# EAGLE design 2seri1çıkış (EAGLE 9.6.2)
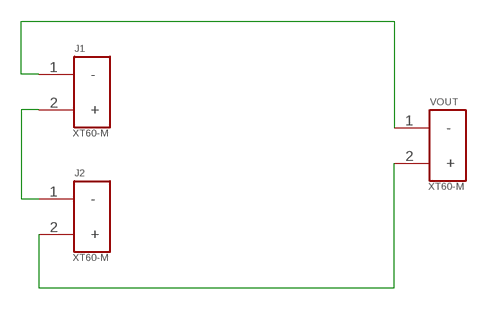
[diagram p0: schematic, sheet 1]

## Parts
J1  XT60-M  [AMASS_XT60-M]
J2  XT60-M  [AMASS_XT60-M]
VOUT  XT60-M  [AMASS_XT60-M]

## Nets
N$1: J1.2(+) J2.1(-)
N$2: J2.2(+) VOUT.2(+)
N$3: J1.1(-) VOUT.1(-)

## Library data of the parts
J1 J2 VOUT = XT60-M:XT60-M: DC supply; XT60; male; PIN:2; for cable; soldered; 60A; 500V; AVAILABILITY: Unavailable; DESCRIPTION: Plug; DC supply; XT60; male; PIN: 2; for cable; soldered; 30A; 500V; MF: AMASS; MP: XT60-M; PACKAGE: Package; PRICE: None

## Board
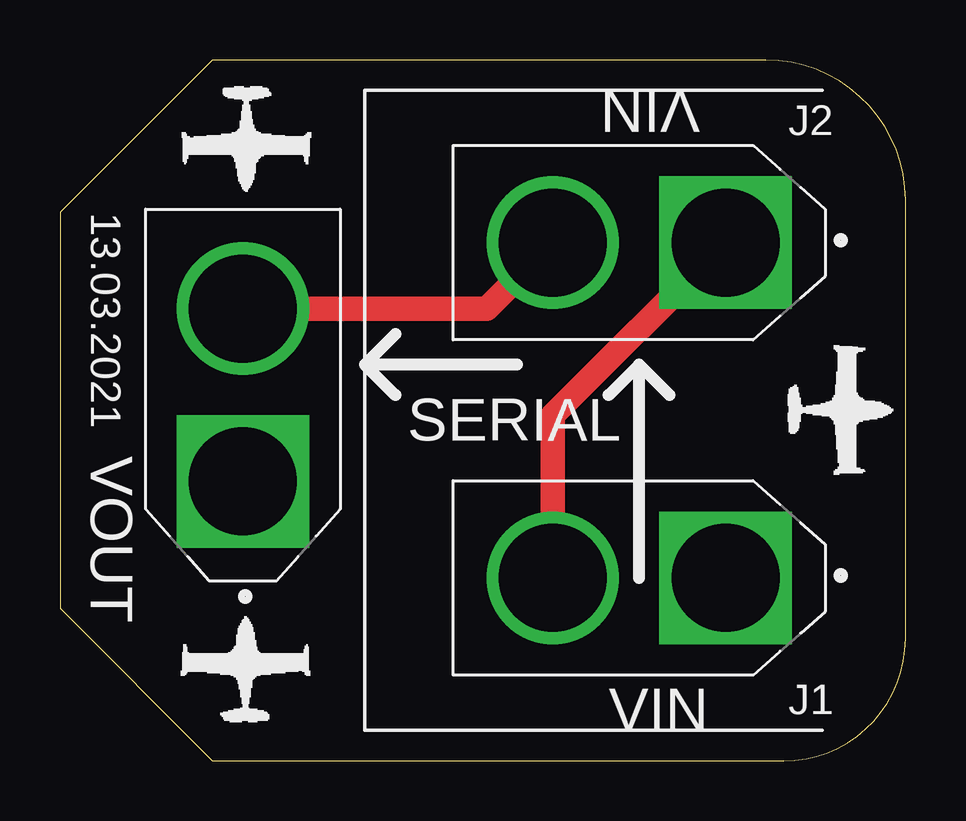
[diagram p1: board, top side]
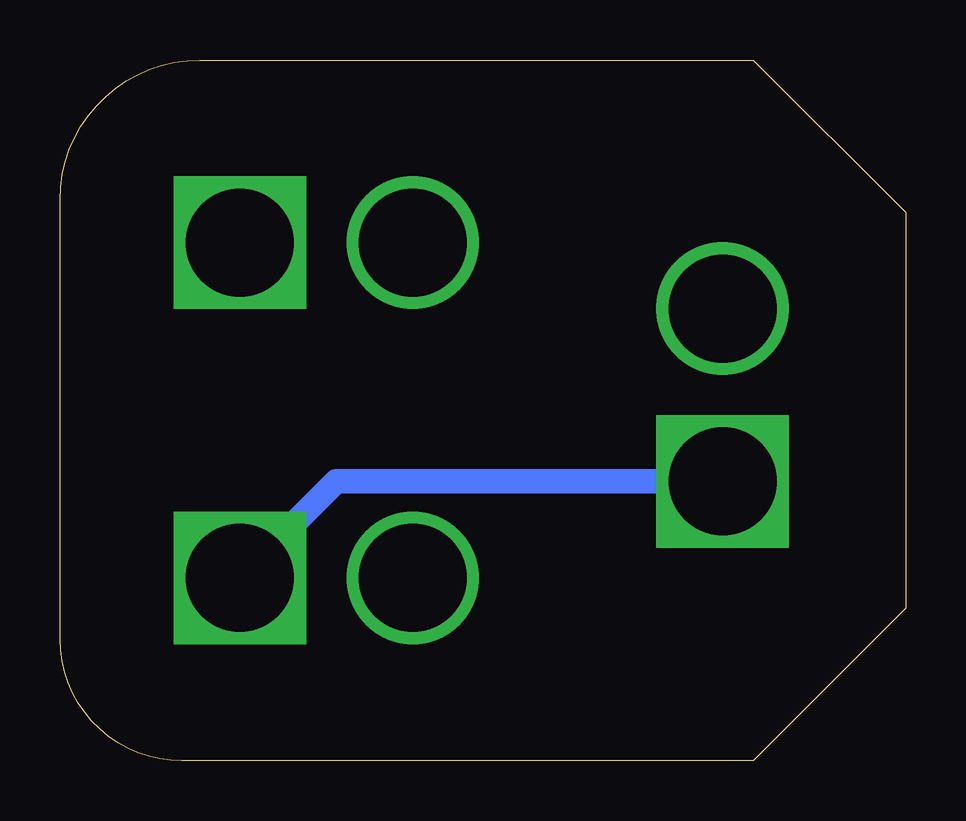
[diagram p2: board, bottom side, seen from below]

Size 35.23 x 29.2 mm. Coordinates in mm from the lower left corner, seen from the top.
Outline: 29.4,29.2 6.34,29.2 0,22.86 0,6.35 6.35,0 30.15,0 arc90 35.23,5.08 35.23,23.37 arc90 29.4,29.2
Copper layers (1*16): Top 0.035mm / dielectric 1.5mm / Bottom 0.035mm
Design rules "default": minimum track width 6mil, minimum drill 0.35mm, track to track 6mil, track to pad 6mil, pad to pad 6mil, via to via 6mil, smd to smd 6mil, copper to edge 40mil, drill to drill 6mil, minimum pad ring 10mil, minimum via ring 8mil, stop-mask expansion 4mil, vias tented up to drill 0mil, thermal gap 10mil

### Footprints (pad centres in the part's own frame; a part is rotated, then mirrored left to right if it is on the bottom)
AMASS_XT60-M = drill 4.5 square: 1 -3.6,0 | drill 4.5: 2 3.6,0

### Placement (x,y rotation side)
J1  24.13,7.62 180 top
J2  24.13,21.59 180 top
VOUT  7.62,15.24 90 top

### Tracks (layer width: path | path; a pad name or v marks a point on that pad's centre or on a via)
N$1
  Top 1.016: J1.2 20.53,14.39 J2.1
N$2
  Top 1.016: J2.2 17.78,18.84 VOUT.2
N$3
  Bottom 1.016: J1.1 23.71,11.64 VOUT.1

### Text on the board
tNames: VIN | 13.03.2021 | VOUT | SERIAL | VIN